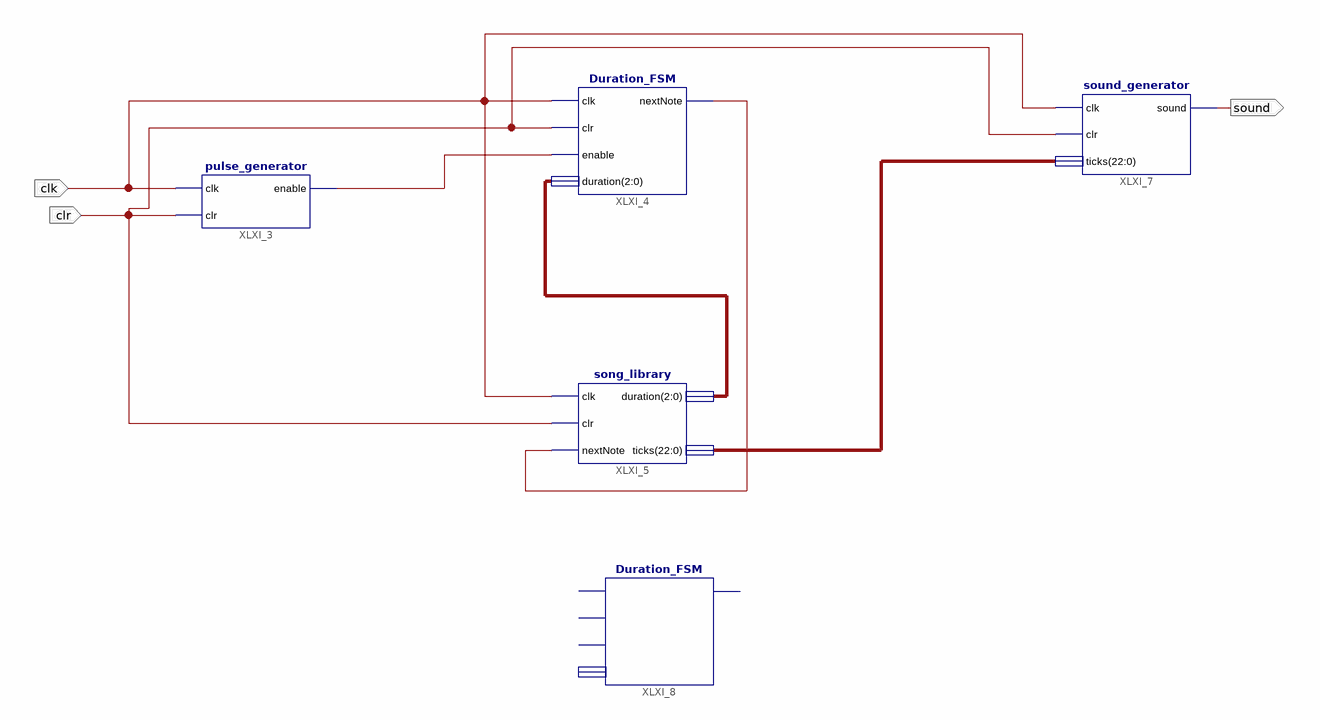
[diagram p0: schematic sheet 1]
// Xilinx ISE schematic MusicSynthesizer.sch (spartan6) as structural Verilog: 5 symbols, 3 ports
module MusicSynthesizer (
  input  clk,
  input  clr,
  output sound
);

  wire XLXN_3, XLXN_6;
  wire [2:0] XLXN_5;
  wire [22:0] XLXN_12;

  pulse_generator XLXI_3 (.clk(clk), .clr(clr), .enable(XLXN_3));
  Duration_FSM XLXI_4 (.clk(clk), .clr(clr), .enable(XLXN_3), .duration(XLXN_5), .nextNote(XLXN_6));
  song_library XLXI_5 (.clk(clk), .clr(clr), .nextNote(XLXN_6), .duration(XLXN_5), .ticks(XLXN_12));
  sound_generator XLXI_7 (.clk(clk), .clr(clr), .ticks(XLXN_12), .sound(sound));
  Duration_FSM XLXI_8 ();  // open: clk, clr, enable, duration, nextNote
endmodule
